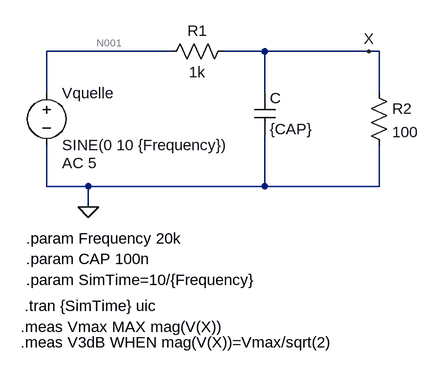
[diagram p0: schematic UE4_capacitorTest.asc]
UE4_capacitorTest.asc, the LTspice schematic file:
Version 4
SHEET 1 880 680
WIRE 96 -32 -96 -32
WIRE 240 -32 176 -32
WIRE 400 -32 240 -32
WIRE 416 -32 400 -32
WIRE -96 32 -96 -32
WIRE 240 32 240 -32
WIRE 416 32 416 -32
WIRE -96 176 -96 112
WIRE -32 176 -96 176
WIRE 240 176 240 96
WIRE 240 176 -32 176
WIRE 416 176 416 112
WIRE 416 176 240 176
WIRE -32 208 -32 176
FLAG -32 208 0
FLAG 400 -32 X
SYMBOL res 80 -16 R270
WINDOW 0 32 56 VTop 2
WINDOW 3 0 56 VBottom 2
SYMATTR InstName R1
SYMATTR Value 1k
SYMBOL res 400 16 R0
SYMATTR InstName R2
SYMATTR Value 100
SYMBOL cap 224 32 R0
SYMATTR InstName C
SYMATTR Value {CAP}
SYMBOL voltage -96 16 R0
WINDOW 123 24 124 Left 2
WINDOW 39 0 0 Left 0
SYMATTR InstName Vquelle
SYMATTR Value SINE(0 10 {Frequency})
SYMATTR Value2 AC 5
TEXT -130 360 Left 2 !.tran {SimTime} uic
TEXT -136 392 Left 2 !.meas Vmax MAX mag(V(X))
TEXT -136 416 Left 2 !.meas V3dB WHEN mag(V(X))=Vmax/sqrt(2)
TEXT -128 288 Left 2 !.param CAP 100n
TEXT -128 256 Left 2 !.param Frequency 20k
TEXT -128 320 Left 2 !.param SimTime=10/{Frequency}

The netlist it stands for:
* UE4_capacitorTest.asc
R1 N001 X 1k
R2 X 0 100
C X 0 {CAP}
Vquelle N001 0 SINE(0 10 {Frequency}) AC 5
.tran {SimTime} uic
.meas Vmax MAX mag(V(X))
.meas V3dB WHEN mag(V(X))=Vmax/sqrt(2)
.param CAP 100n
.param Frequency 20k
.param SimTime=10/{Frequency}
.backanno
.end

* Results of the author's LTspice run, read from the files saved beside the schematic
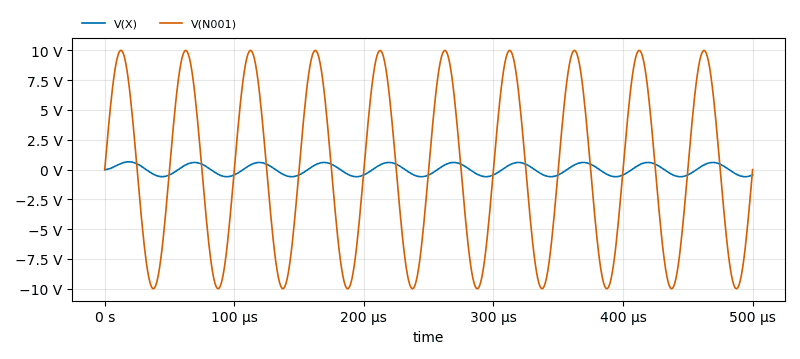
[diagram p1: Transient Analysis of UE4_capacitorTest.asc, plotted from the saved traces]
* Transient Analysis, 1 run:
*   V(X): min -598.1 mV, max 654.1 mV, average 8.201 mV, rms 425.1 mV, last -450.5 mV
*   V(N001): min -10 V, max 10 V, average 240.5 µV, rms 7.071 V, last 0 V
* From the log:
*   Measurement "vmax" FAIL'ed
*   Measurement "v3db" FAIL'ed